# Altium schematic sheet Sheet_cc.SchDoc
size A; SheetNumber: 1; SheetTotal: 1
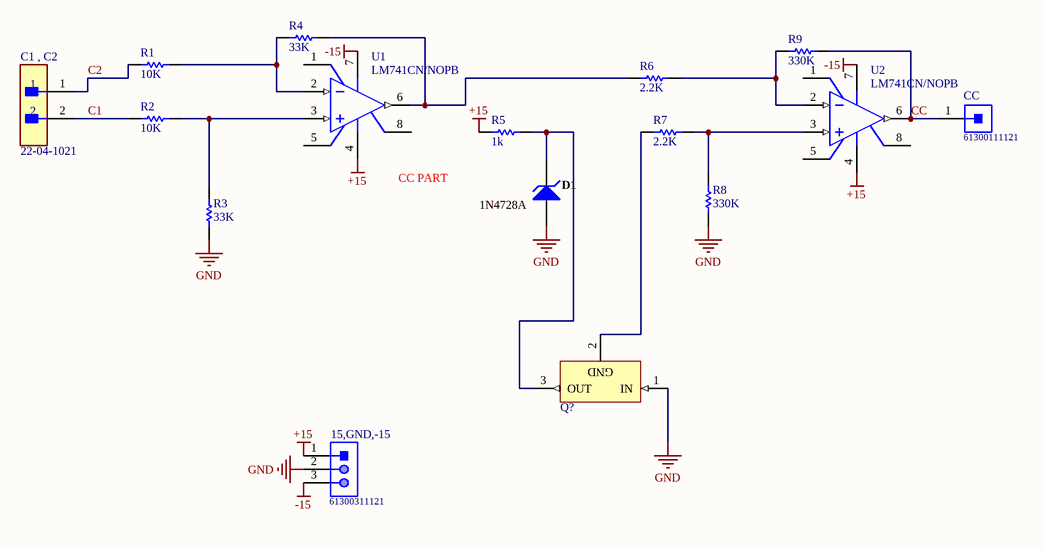
[diagram p0: Sheet_cc.SchDoc]

## Parts
15,GND,-15  61300311121  [61300311121]
C1_,_C2  22-04-1021  [FP-22-04-1021-MFG]
CC  61300111121  [61300111121]
D1  1N4728A  [FAIR-DO-41-2_V]
Q?  (no value)  [FAIR-TO-220-3]
R1  10K  [RESA60-630X240]
R2  10K  [RESA60-630X240]
R3  33K  [RESA60-630X240]
R4  33K  [RESA60-630X240]
R5  1k  [RESA60-630X240]
R6  2.2K  [RESA60-630X240]
R7  2.2K  [RESA60-630X240]
R8  330K  [RESA60-630X240]
R9  330K  [RESA60-630X240]
U1  LM741CN/NOPB  [P0008A]
U2  LM741CN/NOPB  [P0008A]

## Nets
+15: 15,GND,-15.1 R5.1 U1.4(V-) U2.4(V-)
-15: 15,GND,-15.3 U1.7(V+) U2.7(V+)
GND: 15,GND,-15.2 D1.1(A) Q?.1(IN) R3.1 R8.1
C1: C1_,_C2.2 R2.1
C2: C1_,_C2.1 R1.1
CC: CC.1 R9.2 U2.6(OUT)
NetD1_2: D1.2(K) Q?.3(OUT) R5.2
NetQ?_2: Q?.2(GND) R7.1
NetR1_2: R1.2 R4.1 U1.2(IN-)
NetR2_2: R2.2 R3.2 U1.3(IN+)
NetR4_2: R4.2 R6.1 U1.6(OUT)
NetR6_2: R6.2 R9.1 U2.2(IN-)
NetR7_2: R7.2 R8.2 U2.3(IN+)

Not connected (* = marked no-connect by the designer): U1 1(OFS_NULL) 5(OFS_NULL) 8(NC); U2 1(OFS_NULL) 5(OFS_NULL) 8(NC)

## Notes on the sheet
- (near U1) CC PART

## Library data of the parts
15,GND,-15 = CMP-1502-01062-1: THT Vertical Pin Header WR-PHD, Pitch 2.54 mm, Single Row, 3 pins; Manufacturer: Wurth Elektronik; Withstanding Voltage: 500VAC; Working Voltage: 250VAC; Rated Current: 3A; Pitch: 2.54mm; Pin Number: 3; Gender: Male; Contact Resistance: 20mOhm; Package Reference: 61300311121; Manufacturer URL: http://www.we-online.de; Datasheet URL: https://katalog.we-online.de/em/datasheet/6130xx11121.pdf; Operating Temperature: -40to105degC; Part Number: 61300311121; Orientation: Vertical; Packaging: Bag; Row Number: Single; Mounting Technology: THT; Publisher: WurthElektronik
C1_,_C2 = CMP-04776-000257-1: CONN HEADER VERT 2POS 2.5MM; Number of Circuits: 2; Gender: Male; Insulation Resistance: 1GR; Voltage Rating (DC): 250V; Contact Post Length: 0.134inch; Glow Wire Compliant: Non-compliant; Flammability Rating: UL94 V-0; Packaging: Bulk; Contact Mating Length: 0.295inch; Weight: 0.007055oz; Lead Free: Lead Free; Fastening Type: Friction; Contact Type: -; Connector Type: Header; Contact Shape: Square; Insulation Color: Natural; Mount: Through Hole; Halogen Free: Low Halogen; Termination: Through Hole; Contact Plating: Tin; Insulation Height: 0.461inch; RoHS Compliant: Yes; Insulation Material: Nylon; Number of Positions: 2; Series: 5045; Package Quantity: 1000; Number of Rows: 1; Contact Material: Tin
CC = CMP-1502-01058-1: THT Vertical Pin Header WR-PHD, Pitch 2.54 mm, Single Row, 1 pins; Manufacturer: Wurth Elektronik; Gender: Male; Working Voltage: 250VAC; Withstanding Voltage: 500VAC; Pin Number: 1; Contact Resistance: 20mOhm; Rated Current: 3A; Pitch: 2.54mm; Mounting Technology: THT; Datasheet URL: https://katalog.we-online.de/em/datasheet/6130xx11121.pdf; Manufacturer URL: http://www.we-online.de; Operating Temperature: -40to105degC; Publisher: WurthElektronik; Part Number: 61300111121; Row Number: Single; Package Reference: 61300111121; Orientation: Vertical; Packaging: Bag
D1 = CMP-0892-00028-1: Zener Diode, 3.3V, 1W, 5%, -65 to 200 degC, 2-Pin DO-41, Body 2.72 x 5.2 mm, RoHS; Manufacturer: Fairchild Semiconductor; PD (W): 1; VZ (Max.) (V): 3.465; IR (uA): 100; ZZ (Max) (ohm): 10; Test Current IZ (mA): 76; VZ (Min.) (V): 3.135; DatasheetVersion: Rev. H3; Tolerance: 5%; ComponentLink3URL: http://www.fairchildsemi.com/dwg/DO/DO41A.pdf; ComponentLink2Description: Datasheet; PackageDescription: 2-Pin Axial leaded, Body 2.72 x 5.2 mm, Lead Spread 25.4 mm; PartNumber: 1N4728A; Operating and Storage Temperature Range: -65 to 200 degC; Mounting Technology: Through Hole; ComponentLink3Description: Package Specification; PackageReference: DO-41-2; ComponentLink1URL: http://www.fairchildsemi.com/; RoHS: TRUE; ComponentLink1Description: Manufacturer URL; ComponentLink2URL: http://www.fairchildsemi.com/ds/1N/1N4744A.pdf; PackageVersion: Rev. 2
Q? = CMP-2000-04938-1: Positive Voltage Regulator, 5 V, 1 A, -40 to 125 degC, 3-Pin TO-220, RoHS, Tube; Manufacturer: FairchildSemiconductor; Maximum Input Voltage: 35V; Maximum Quiescent Current: 8mA; Load Regulation: 100mV; Maximum Output Current: 2.2(Typ)A; Output Type: Fixed; Typical Dropout Voltage @ Current: 2@1AV; Rad Hard: No; Output Voltage: 5V; Accuracy: ±4%; Type: Linear; Number of Outputs: 1; Category: LinearRegulator; Package Description: 3-Pin Through Hole Device, Body 10 x 4.5 mm, Pitch 2.54 mm; Packaging: Rail/Tube; Mounting: ThroughHole; Polarity: Positive; Manufacturer URL: https://www.fairchildsemi.com/; Line Regulation: 100mV; Datasheet Version: Aug-12; Datasheet URL: https://datasheet.ciiva.com/26904/lm7805ct-26904988.pdf; Package Reference: TO-220; Package URL: https://www.fairchildsemi.com/package-drawings/TO/TO220B03.pdf; Package: 3TO-220AB; Operating Temperature: -40to125degC
R1-R9 = CMP-1659-00075-1: Axial Resistor, 1 KOhm, +/- 1%, 250 mW, -55 to 155 degC, 2-Pin THD, RoHS, Bulk; Voltage Rating: 250 V; Resistance: 10 kohm; Power Rating: 250 mW; ComponentLink2Description: Datasheet; RoHSCompliant: true; PackageReference: MFR-25; Case\Package: Axial; Max Operating Temperature: 155 degC; DatasheetVersion: Apr-13; Tolerance: 1%; ComponentLink1URL: http://www.yageo.com/; Length: 0.248 inch; ComponentLink2URL: http://www.yageo.com/documents/recent/Yageo%20LR_MFR_2013.pdf; Packaging: Bulk; Package Quantity: 200; PackageDescription: 2-Pin Axial Lead, Dia 2.4 mm, Body Length 6.3 mm; Min Operating Temperature: -55 degC; ComponentLink1Description: Manufacturer URL
U1 U2 = CMP-0055-00162-3: Operational Amplifier, 8-pin MDIP, Pb-Free; Manufacturer: Texas Instruments; PackageTopMarking: NSUZXYTTE#*LM*741CN; PowerWise: N; CompType: Amplifiers; ComponentLink1Description: Datasheet URL; ComponentLink1URL: http://www.ti.com/general/docs/lit/getliterature.tsp?genericPartNumber=LM741&fileType=pdf; PackageDescription: MDIP, .365 x .250 x .130in, 8 Lead, .100in Pitch; RoHS: Y; PinCount: 8; Code_JEDEC: MS-001-BA; Package Reference: P0008A